# Altium schematic sheet S7CAS-PLEIADES-CARTE-MERE_Pxx_OVERVIEW.SchDoc
size Tabloid; SheetNumber: 2; SheetTotal: 18; Sheet_Name: OVERVIEW; Size: 11x17
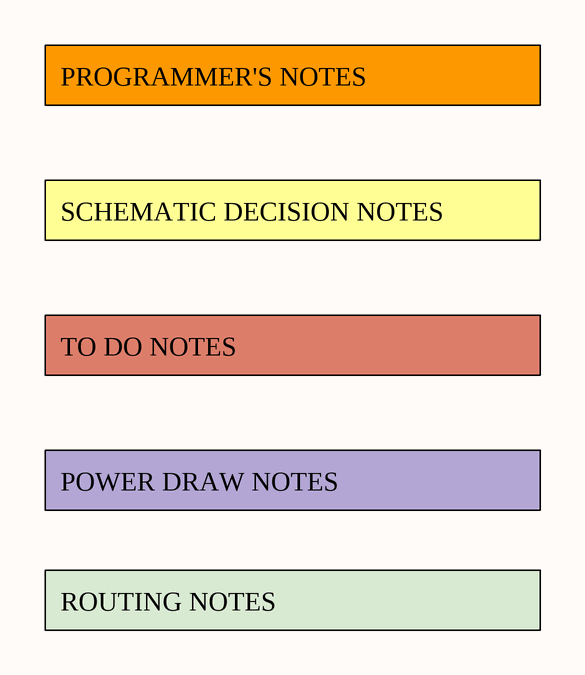
[diagram p0: S7CAS-PLEIADES-CARTE-MERE_Pxx_OVERVIEW.SchDoc]

## Notes on the sheet
- PROGRAMMER'S NOTES
- SCHEMATIC DECISION NOTES
- TO DO NOTES
- POWER DRAW NOTES
- ROUTING NOTES
- Sheet Name
- Project Title
- Global Project
- Size
- Group
- Revision
- Date
- Sheet
- of
- Filename
- Designers